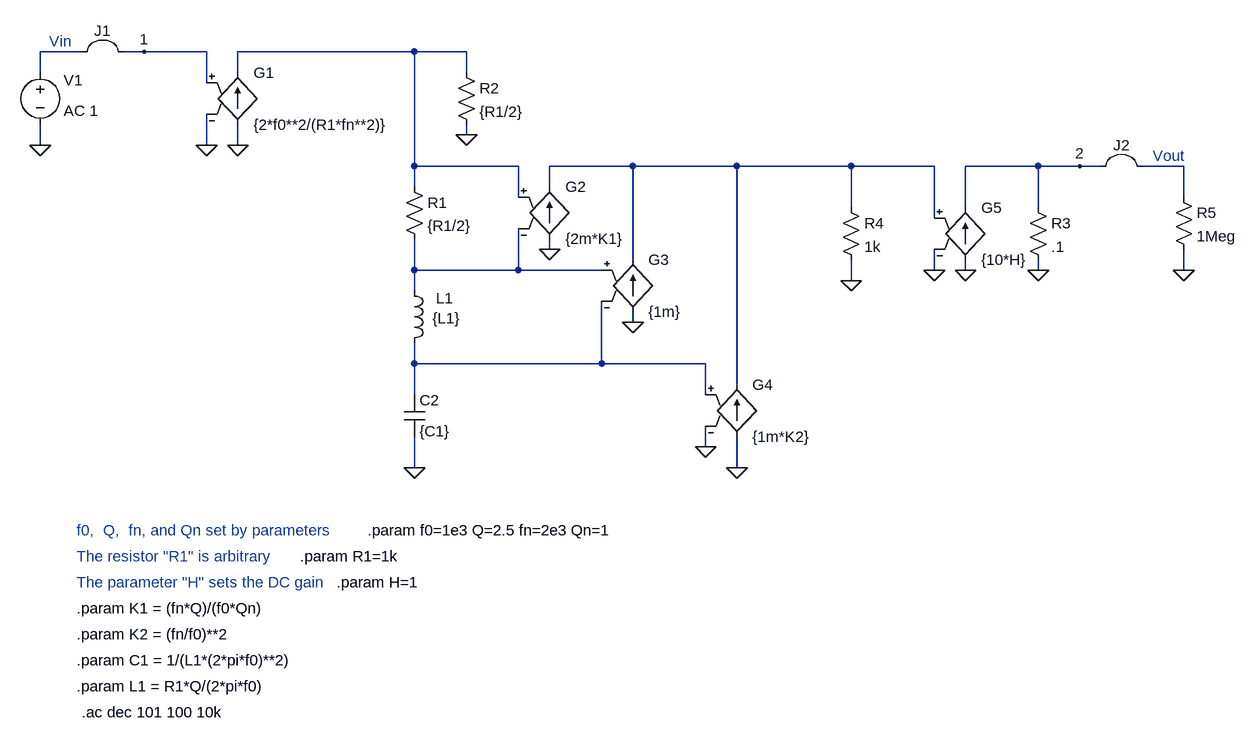
[diagram p0: schematic 2ndOrderComplexzero.asc]
2ndOrderComplexzero.asc, the LTspice schematic file:
Version 4
SHEET 1 1060 904
WIRE -960 -128 -1024 -128
WIRE -864 -128 -896 -128
WIRE -768 -128 -864 -128
WIRE -448 -128 -720 -128
WIRE -368 -128 -448 -128
WIRE -1024 -96 -1024 -128
WIRE -720 -96 -720 -128
WIRE -368 -96 -368 -128
WIRE -768 -80 -768 -128
WIRE -368 0 -368 -16
WIRE -1024 16 -1024 -16
WIRE -768 16 -768 -32
WIRE -720 16 -720 -16
WIRE -448 48 -448 -128
WIRE -288 48 -448 48
WIRE -112 48 -240 48
WIRE 48 48 -112 48
WIRE 224 48 48 48
WIRE 352 48 224 48
WIRE 512 48 400 48
WIRE 576 48 512 48
WIRE 608 48 576 48
WIRE 736 48 672 48
WIRE -448 80 -448 48
WIRE -240 80 -240 48
WIRE -288 96 -288 48
WIRE 736 96 736 48
WIRE 224 112 224 48
WIRE 400 112 400 48
WIRE 512 112 512 48
WIRE 352 128 352 48
WIRE -240 176 -240 160
WIRE -112 192 -112 48
WIRE -448 208 -448 160
WIRE -288 208 -288 144
WIRE -288 208 -448 208
WIRE -160 208 -288 208
WIRE 352 208 352 176
WIRE 400 208 400 192
WIRE 512 208 512 192
WIRE 736 208 736 176
WIRE 224 224 224 192
WIRE -448 240 -448 208
WIRE -112 288 -112 272
WIRE -448 352 -448 320
WIRE -160 352 -160 256
WIRE -160 352 -448 352
WIRE 0 352 -160 352
WIRE 48 384 48 48
WIRE -448 400 -448 352
WIRE 0 400 0 352
WIRE 0 480 0 448
WIRE -448 512 -448 464
WIRE 48 512 48 464
FLAG -720 16 0
FLAG -768 16 0
FLAG -368 0 0
FLAG -448 512 0
FLAG 224 224 0
FLAG -240 176 0
FLAG -112 288 0
FLAG 48 512 0
FLAG 0 480 0
FLAG -864 -128 1
FLAG 352 208 0
FLAG 400 208 0
FLAG 512 208 0
FLAG 576 48 2
FLAG 736 208 0
FLAG -1024 16 0
SYMBOL g -720 -112 R0
SYMATTR InstName G1
SYMATTR Value {2*f0**2/(R1*fn**2)}
SYMBOL res -384 -112 R0
SYMATTR InstName R2
SYMATTR Value {R1/2}
SYMBOL g -240 64 R0
SYMATTR InstName G2
SYMATTR Value {2m*K1}
SYMBOL res 208 96 R0
SYMATTR InstName R4
SYMATTR Value 1k
SYMBOL ind -464 224 R0
WINDOW 0 49 27 Left 2
WINDOW 3 44 58 Left 2
SYMATTR InstName L1
SYMATTR Value {L1}
SYMBOL res -464 64 R0
SYMATTR InstName R1
SYMATTR Value {R1/2}
SYMBOL cap -464 400 R0
SYMATTR InstName C2
SYMATTR Value {C1}
SYMBOL g -112 176 R0
SYMATTR InstName G3
SYMATTR Value {1m}
SYMBOL g 48 368 R0
SYMATTR InstName G4
SYMATTR Value {1m*K2}
SYMBOL Misc\\jumper -928 -192 M0
SYMATTR InstName J1
SYMBOL g 400 96 R0
SYMATTR InstName G5
SYMATTR Value {10*H}
SYMBOL res 496 96 R0
SYMATTR InstName R3
SYMATTR Value .1
SYMBOL Misc\\jumper 640 -16 R0
SYMATTR InstName J2
SYMBOL res 720 80 R0
SYMATTR InstName R5
SYMATTR Value 1Meg
SYMBOL voltage -1024 -112 R0
WINDOW 0 36 28 Left 2
WINDOW 123 36 75 Left 2
WINDOW 39 0 0 Left 0
SYMATTR InstName V1
SYMATTR Value2 AC 1
SYMATTR Value ""
TEXT -520 608 Left 2 !.param f0=1e3 Q=2.5 fn=2e3 Qn=1
TEXT -968 608 Left 2 ;f0,  Q,  fn, and Qn set by parameters
TEXT -624 648 Left 2 !.param R1=1k
TEXT -968 728 Left 2 !.param K1 = (fn*Q)/(f0*Qn)
TEXT -968 768 Left 2 !.param K2 = (fn/f0)**2
TEXT -968 848 Left 2 !.param L1 = R1*Q/(2*pi*f0)
TEXT -968 808 Left 2 !.param C1 = 1/(L1*(2*pi*f0)**2)
TEXT -976 -144 Right 2 ;Vin
TEXT 688 32 Left 2 ;Vout
TEXT -968 648 Left 2 ;The resistor "R1" is arbitrary
TEXT -968 688 Left 2 ;The parameter "H" sets the DC gain
TEXT -568 688 Left 2 !.param H=1
TEXT -960 888 Left 2 !.ac dec 101 100 10k

The netlist it stands for:
* 2ndOrderComplexzero.asc
G1 0 N001 1 0 {2*f0**2/(R1*fn**2)}
R2 N001 0 {R1/2}
G2 0 N002 N001 N003 {2m*K1}
R4 N002 0 1k
L1 N003 N004 {L1}
R1 N001 N003 {R1/2}
C2 N004 0 {C1}
G3 0 N002 N003 N004 {1m}
G4 0 N002 N004 0 {1m*K2}
G5 0 2 N002 0 {10*H}
R3 2 0 .1
R5 2 0 1Meg
V1 1 0 AC 1
.param f0=1e3 Q=2.5 fn=2e3 Qn=1
* f0,  Q,  fn, and Qn set by parameters
.param R1=1k
.param K1 = (fn*Q)/(f0*Qn)
.param K2 = (fn/f0)**2
.param L1 = R1*Q/(2*pi*f0)
.param C1 = 1/(L1*(2*pi*f0)**2)
* Vin
* Vout
* The resistor "R1" is arbitrary
* The parameter "H" sets the DC gain
.param H=1
.ac dec 101 100 10k
.backanno
.end